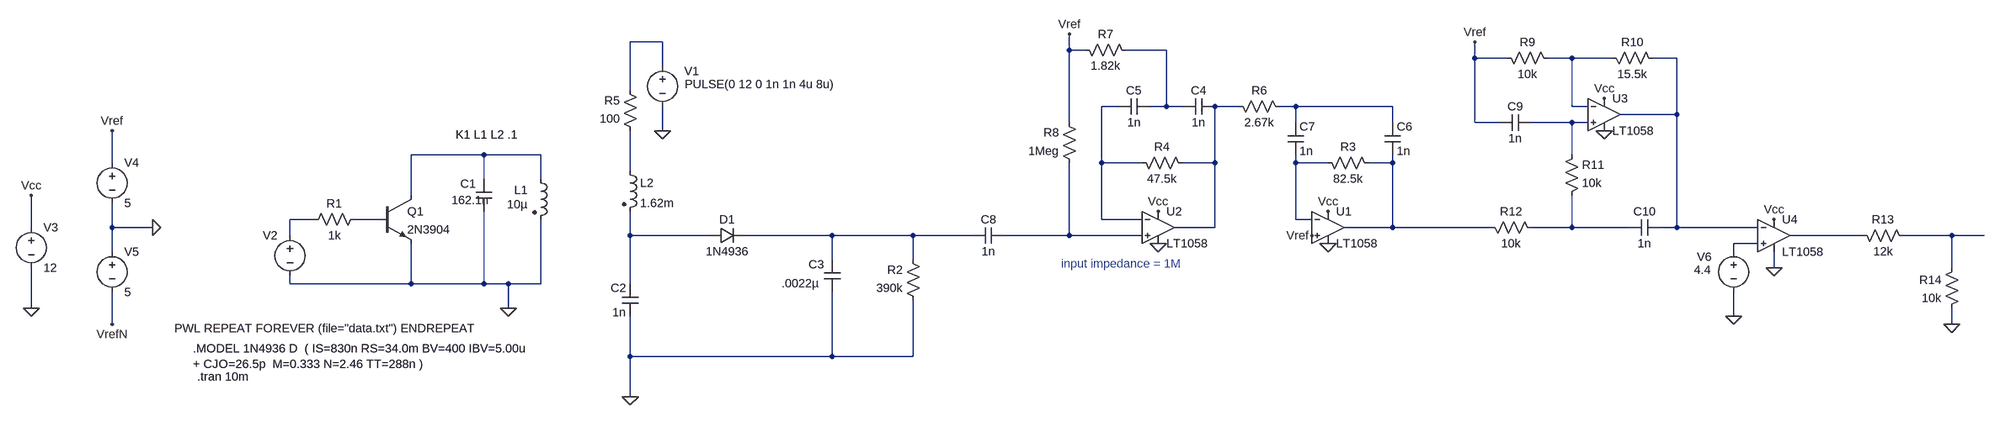
[diagram p0: schematic 125k_reader_sim.asc]
125k_reader_sim.asc, the LTspice schematic file:
Version 4
SHEET 1 3848 1328
WIRE 192 -304 128 -304
WIRE 1072 -288 1072 -320
WIRE 1104 -288 1072 -288
WIRE 1264 -288 1184 -288
WIRE 1968 -272 1968 -304
WIRE 2032 -272 1968 -272
WIRE 2160 -272 2112 -272
WIRE 2240 -272 2160 -272
WIRE 2368 -272 2320 -272
WIRE 192 -256 192 -304
WIRE 128 -208 128 -304
WIRE 1168 -176 1136 -176
WIRE 1264 -176 1264 -288
WIRE 1264 -176 1232 -176
WIRE 1296 -176 1264 -176
WIRE 1408 -176 1360 -176
WIRE 1520 -176 1488 -176
WIRE 1712 -176 1520 -176
WIRE 2160 -176 2160 -272
WIRE 2192 -176 2160 -176
WIRE 2368 -160 2368 -272
WIRE 2368 -160 2256 -160
WIRE 1072 -144 1072 -288
WIRE 1520 -144 1520 -176
WIRE 1712 -144 1712 -176
WIRE 1968 -144 1968 -272
WIRE 2016 -144 1968 -144
WIRE 2160 -144 2080 -144
WIRE 2192 -144 2160 -144
WIRE 192 -128 192 -176
WIRE -208 -80 -352 -80
WIRE -96 -80 -208 -80
WIRE 2160 -80 2160 -144
WIRE -944 -64 -944 -128
WIRE 1136 -64 1136 -176
WIRE 1216 -64 1136 -64
WIRE 1360 -64 1360 -176
WIRE 1360 -64 1296 -64
WIRE 1520 -64 1520 -80
WIRE 1584 -64 1520 -64
WIRE 1712 -64 1712 -80
WIRE 1712 -64 1664 -64
WIRE 128 -48 128 -128
WIRE -208 -32 -208 -80
WIRE -96 -32 -96 -80
WIRE -352 0 -352 -80
WIRE -544 48 -592 48
WIRE -416 48 -464 48
WIRE 1136 48 1136 -64
WIRE 1216 48 1136 48
WIRE 1520 48 1520 -64
WIRE 1552 48 1520 48
WIRE -1104 64 -1104 0
WIRE -944 64 -944 16
WIRE -864 64 -944 64
WIRE 1360 64 1360 -64
WIRE 1360 64 1280 64
WIRE 1712 64 1712 -64
WIRE 1712 64 1616 64
WIRE 2000 64 1712 64
WIRE 2160 64 2160 0
WIRE 2160 64 2080 64
WIRE 2272 64 2160 64
WIRE 2368 64 2368 -160
WIRE 2368 64 2336 64
WIRE 2528 64 2368 64
WIRE -592 80 -592 48
WIRE 128 80 128 32
WIRE 288 80 128 80
WIRE 528 80 352 80
WIRE 688 80 528 80
WIRE 880 80 688 80
WIRE 1072 80 1072 -64
WIRE 1072 80 944 80
WIRE 1216 80 1072 80
WIRE 2736 80 2592 80
WIRE 2912 80 2816 80
WIRE 2976 80 2912 80
WIRE 2528 96 2480 96
WIRE -944 112 -944 64
WIRE 2480 112 2480 96
WIRE 528 128 528 80
WIRE 688 128 688 80
WIRE 2560 144 2560 112
WIRE 2912 144 2912 80
WIRE -592 176 -592 160
WIRE -352 176 -352 96
WIRE -352 176 -592 176
WIRE -208 176 -208 32
WIRE -208 176 -352 176
WIRE -160 176 -208 176
WIRE -96 176 -96 48
WIRE -96 176 -160 176
WIRE 128 176 128 80
WIRE -1104 224 -1104 144
WIRE -160 224 -160 176
WIRE 2480 240 2480 192
WIRE -944 256 -944 192
WIRE 2912 256 2912 224
WIRE 128 320 128 240
WIRE 528 320 528 192
WIRE 528 320 128 320
WIRE 688 320 688 208
WIRE 688 320 528 320
WIRE 128 400 128 320
FLAG -160 224 0
FLAG 128 400 0
FLAG 192 -128 0
FLAG -944 -128 Vref
FLAG -864 64 0
FLAG -1104 0 Vcc
FLAG -1104 224 0
FLAG -944 256 VrefN
FLAG 1552 80 Vref
FLAG 1072 -320 Vref
FLAG 1248 96 0
FLAG 1584 96 0
FLAG 1248 32 Vcc
FLAG 1584 32 Vcc
FLAG 1968 -304 Vref
FLAG 2224 -128 0
FLAG 2224 -192 Vcc
FLAG 2912 256 0
FLAG 2560 144 0
FLAG 2560 48 Vcc
FLAG 2480 240 0
SYMBOL ind2 112 -64 R0
SYMATTR InstName L2
SYMATTR Value 1.62m
SYMBOL cap 144 176 M0
SYMATTR InstName C2
SYMATTR Value 1n
SYMBOL ind2 -112 -48 R0
WINDOW 0 -36 38 Left 2
WINDOW 3 -50 66 Left 2
SYMATTR InstName L1
SYMATTR Value 10µ
SYMATTR SpiceLine Rser=.1
SYMBOL cap -224 -32 R0
WINDOW 0 -31 9 Left 2
WINDOW 3 -48 42 Left 2
SYMATTR InstName C1
SYMATTR Value 162.1n
SYMBOL voltage 192 -272 R0
WINDOW 0 43 26 Left 2
WINDOW 3 44 52 Left 2
SYMATTR InstName V1
SYMATTR Value PULSE(0 12 0 1n 1n 4u 8u)
SYMBOL npn -416 0 R0
SYMATTR InstName Q1
SYMATTR Value 2N3904
SYMBOL voltage -592 64 M0
WINDOW 3 -364 200 Left 2
SYMATTR Value PWL REPEAT FOREVER (file="data.txt") ENDREPEAT
SYMATTR InstName V2
SYMBOL res -448 32 R90
WINDOW 0 0 56 VBottom 2
WINDOW 3 32 56 VTop 2
SYMATTR InstName R1
SYMATTR Value 1k
SYMBOL res 144 -112 R180
WINDOW 0 36 76 Left 2
WINDOW 3 36 40 Left 2
SYMATTR InstName R5
SYMATTR Value 100
SYMBOL diode 288 96 R270
WINDOW 0 32 32 VTop 2
WINDOW 3 0 32 VBottom 2
SYMATTR InstName D1
SYMATTR Value 1N4936
SYMBOL cap 512 128 R0
WINDOW 0 -31 9 Left 2
WINDOW 3 -84 47 Left 2
SYMATTR InstName C3
SYMATTR Value .0022µ
SYMBOL res 704 224 R180
WINDOW 0 36 76 Left 2
WINDOW 3 36 40 Left 2
SYMATTR InstName R2
SYMATTR Value 390k
SYMBOL voltage -1104 48 R0
SYMATTR InstName V3
SYMATTR Value 12
SYMBOL voltage -944 -80 R0
SYMATTR InstName V4
SYMATTR Value 5
SYMBOL voltage -944 96 R0
SYMATTR InstName V5
SYMATTR Value 5
SYMBOL OpAmps/LT1058 1584 0 R0
SYMATTR InstName U1
SYMBOL OpAmps/LT1058 1248 0 R0
SYMATTR InstName U2
SYMBOL res 1568 -80 M90
WINDOW 0 0 56 VBottom 2
WINDOW 3 32 56 VTop 2
SYMATTR InstName R3
SYMATTR Value 82.5k
SYMBOL res 1200 -80 M90
WINDOW 0 0 56 VBottom 2
WINDOW 3 32 56 VTop 2
SYMATTR InstName R4
SYMATTR Value 47.5k
SYMBOL cap 1296 -192 M90
WINDOW 0 0 32 VBottom 2
WINDOW 3 32 32 VTop 2
SYMATTR InstName C4
SYMATTR Value 1n
SYMBOL cap 1168 -192 M90
WINDOW 0 0 32 VBottom 2
WINDOW 3 32 32 VTop 2
SYMATTR InstName C5
SYMATTR Value 1n
SYMBOL cap 1504 -80 M180
WINDOW 0 24 56 Left 2
WINDOW 3 24 8 Left 2
SYMATTR InstName C7
SYMATTR Value 1n
SYMBOL res 1392 -192 M90
WINDOW 0 0 56 VBottom 2
WINDOW 3 32 56 VTop 2
SYMATTR InstName R6
SYMATTR Value 2.67k
SYMBOL res 1088 -304 M90
WINDOW 0 0 56 VBottom 2
WINDOW 3 32 56 VTop 2
SYMATTR InstName R7
SYMATTR Value 1.82k
SYMBOL res 1088 -48 R180
WINDOW 0 36 76 Left 2
WINDOW 3 36 40 Left 2
SYMATTR InstName R8
SYMATTR Value 1Meg
SYMBOL cap 1696 -80 M180
WINDOW 0 24 56 Left 2
WINDOW 3 24 8 Left 2
SYMATTR InstName C6
SYMATTR Value 1n
SYMBOL cap 880 64 M90
WINDOW 0 0 32 VBottom 2
WINDOW 3 32 32 VTop 2
SYMATTR InstName C8
SYMATTR Value 1n
SYMBOL OpAmps/LT1058 2224 -224 R0
SYMATTR InstName U3
SYMBOL res 2016 -288 M90
WINDOW 0 0 56 VBottom 2
WINDOW 3 32 56 VTop 2
SYMATTR InstName R9
SYMATTR Value 10k
SYMBOL res 2224 -288 M90
WINDOW 0 0 56 VBottom 2
WINDOW 3 32 56 VTop 2
SYMATTR InstName R10
SYMATTR Value 15.5k
SYMBOL cap 2016 -160 M90
WINDOW 0 0 32 VBottom 2
WINDOW 3 32 32 VTop 2
SYMATTR InstName C9
SYMATTR Value 1n
SYMBOL res 2144 16 M180
WINDOW 0 36 76 Left 2
WINDOW 3 36 40 Left 2
SYMATTR InstName R11
SYMATTR Value 10k
SYMBOL cap 2272 48 M90
WINDOW 0 0 32 VBottom 2
WINDOW 3 32 32 VTop 2
SYMATTR InstName C10
SYMATTR Value 1n
SYMBOL res 2096 80 M270
WINDOW 0 32 56 VTop 2
WINDOW 3 0 56 VBottom 2
SYMATTR InstName R12
SYMATTR Value 10k
SYMBOL OpAmps/LT1058 2560 16 R0
SYMATTR InstName U4
SYMBOL res 2832 96 M270
WINDOW 0 32 56 VTop 2
WINDOW 3 0 56 VBottom 2
SYMATTR InstName R13
SYMATTR Value 12k
SYMBOL res 2928 128 M0
SYMATTR InstName R14
SYMATTR Value 10k
SYMBOL voltage 2480 96 M0
WINDOW 0 43 26 Left 2
WINDOW 3 44 52 Left 2
SYMATTR InstName V6
SYMATTR Value 4.4
TEXT -776 360 Left 2 !.tran 10m
TEXT -264 -120 Left 2 !K1 L1 L2 .1
TEXT -784 304 Left 2 !.MODEL 1N4936 D  ( IS=830n RS=34.0m BV=400 IBV=5.00u\n+ CJO=26.5p  M=0.333 N=2.46 TT=288n )
TEXT 1056 136 Left 2 ;input impedance = 1M

The netlist it stands for:
* 125k_reader_sim.asc
L2 N012 N016 1.62m
C2 N016 0 1n
L1 N009 0 10µ Rser=.1
C1 N009 0 162.1n
V1 N001 0 PULSE(0 12 0 1n 1n 4u 8u)
Q1 N009 N014 0 0 2N3904
V2 N013 0 PWL REPEAT FOREVER (file="data.txt") ENDREPEAT
R1 N014 N013 1k
R5 N012 N001 100
D1 N016 N017 1N4936
C3 N017 0 .0022µ
R2 0 N017 390k
V3 Vcc 0 12
V4 Vref 0 5
V5 0 VrefN 5
XU1 Vref N010 Vcc 0 N011 LT1057  ; LT1058, pins In+ In- V+ V- OUT
XU2 N018 N005 Vcc 0 N006 LT1057  ; LT1058, pins In+ In- V+ V- OUT
R3 N010 N011 82.5k
R4 N005 N006 47.5k
C4 N002 N006 1n
C5 N005 N002 1n
C7 N010 N007 1n
R6 N006 N007 2.67k
R7 Vref N002 1.82k
R8 N018 Vref 1Meg
C6 N011 N007 1n
C8 N017 N018 1n
XU3 N008 N003 Vcc 0 N004 LT1057  ; LT1058, pins In+ In- V+ V- OUT
R9 Vref N003 10k
R10 N003 N004 15.5k
C9 Vref N008 1n
R11 N015 N008 10k
C10 N015 N004 1n
R12 N015 N011 10k
XU4 N021 N004 Vcc 0 N019 LT1057  ; LT1058, pins In+ In- V+ V- OUT
R13 N020 N019 12k
R14 N020 0 10k
V6 N021 0 4.4
.model D D
.lib standard.dio
.model NPN NPN
.model PNP PNP
.lib standard.bjt
.tran 10m
K1 L1 L2 .1
.MODEL 1N4936 D  ( IS=830n RS=34.0m BV=400 IBV=5.00u
+ CJO=26.5p  M=0.333 N=2.46 TT=288n )
* input impedance = 1M
.lib LTC.lib
.backanno
.end